# EAGLE schematic Micro_Rev1j (EAGLE 7.7.0)
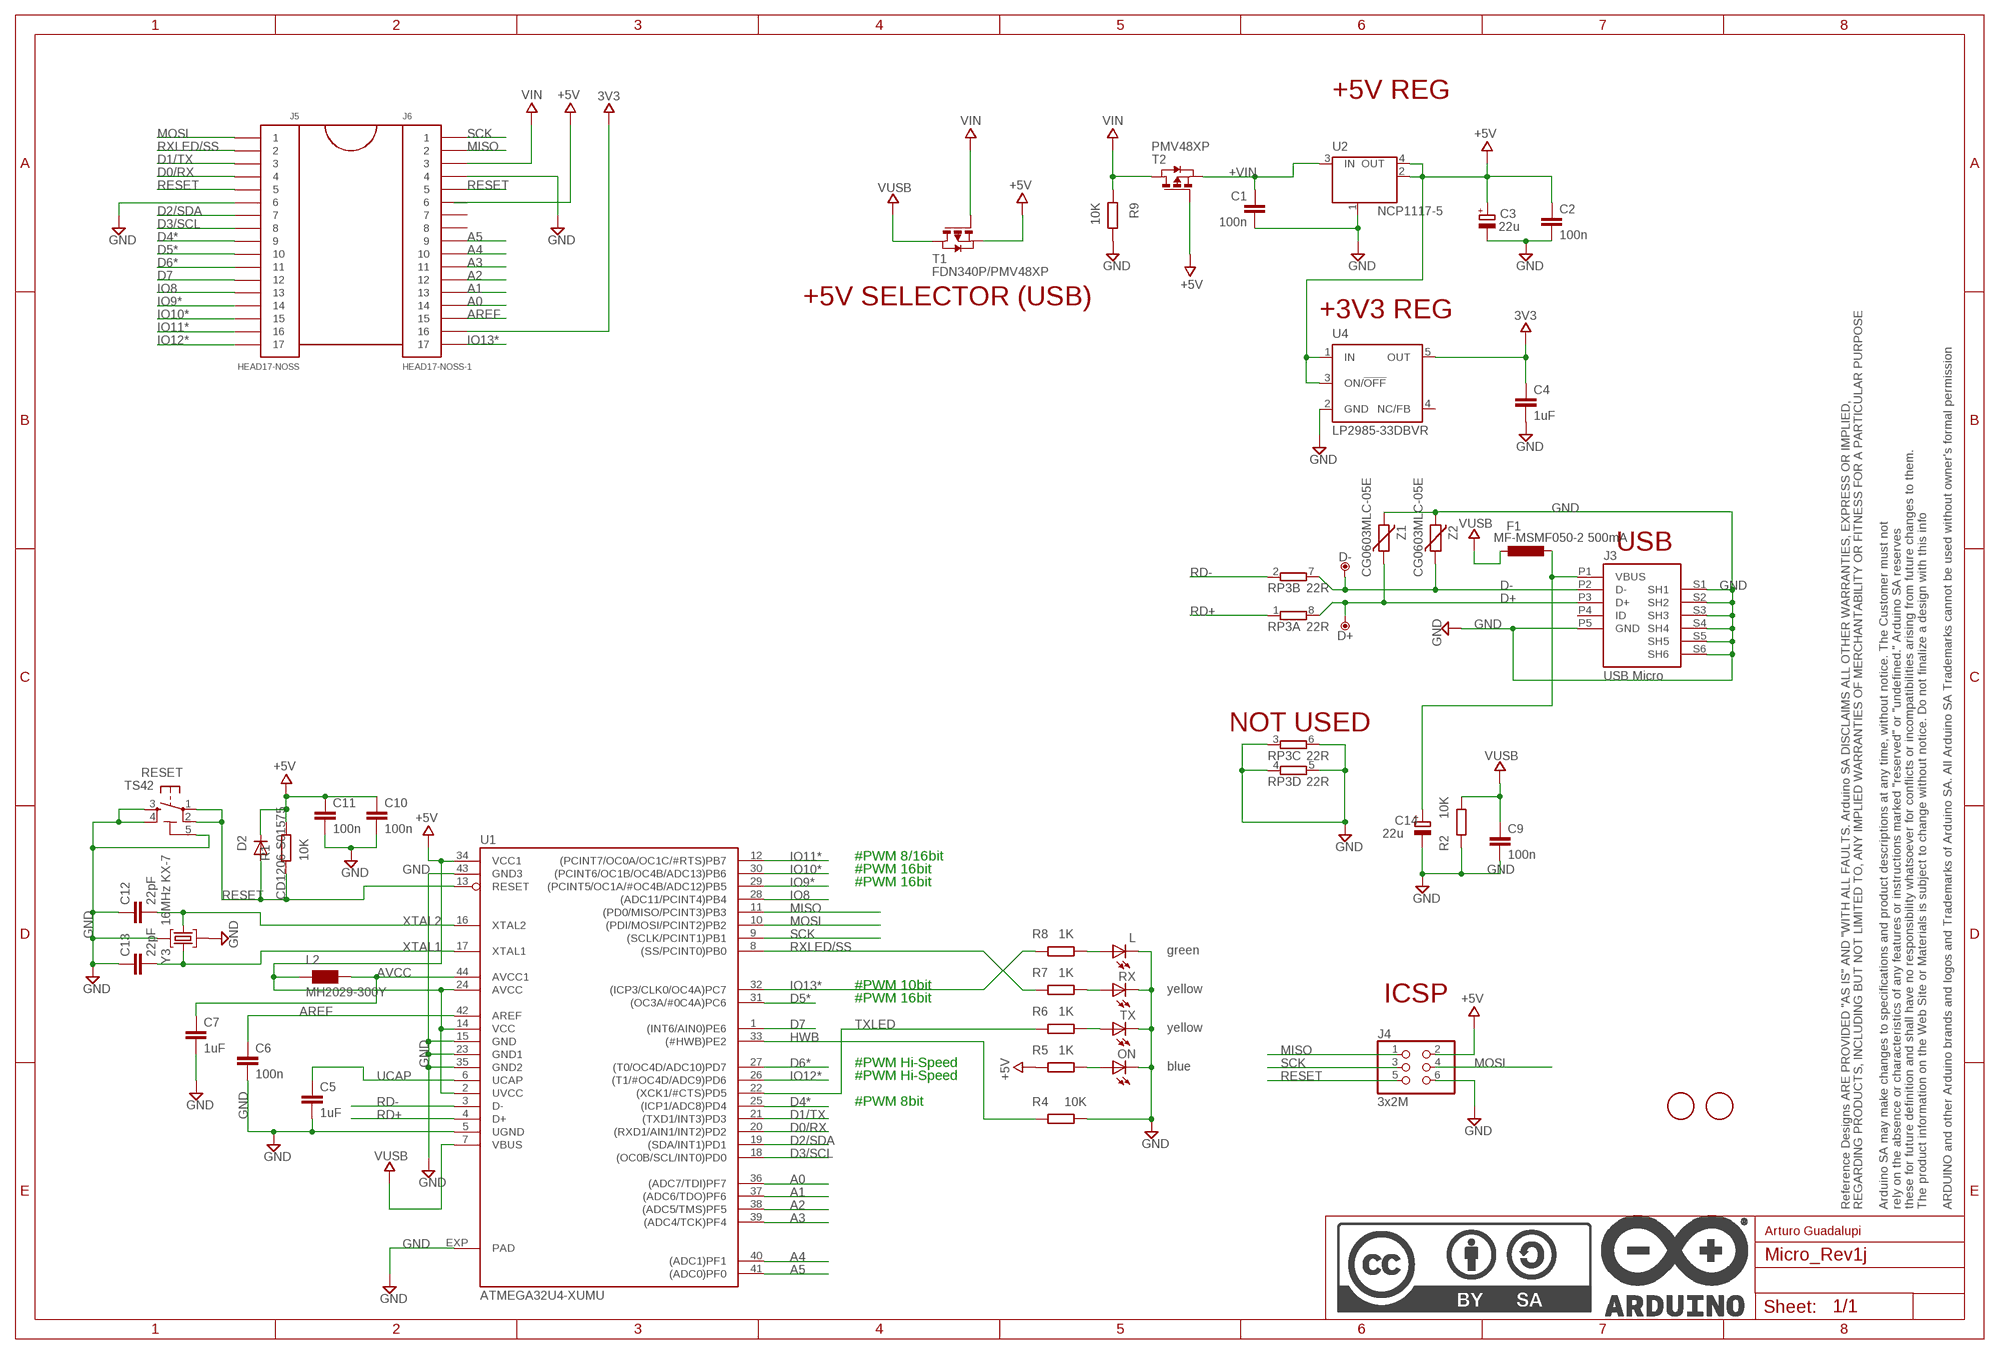
[diagram p0: schematic, sheet 1]

## Parts
C1  100n  C-EUC0402  [C0402]
C2  100n  C-EUC0402  [C0402]
C3  22u  CPOL-EUSMCB  [SMC_B]
C4  1uF  C-EUC0402  [C0402]
C5  1uF  C-EUC0402  [C0402]
C6  100n  C-EUC0402  [C0402]
C7  1uF  C-EUC0402  [C0402]
C9  100n  C-EUC0402  [C0402]
C10  100n  C-EUC0402  [C0402]
C11  100n  C-EUC0402  [C0402]
C12  22pF  C-EUC0402  [C0402]
C13  22pF  C-EUC0402  [C0402]
C14  22u  CPOL-EUSMCB  [SMC_B]
D2  CD1206-S01575  DIODE-MINIMELF  [MINIMELF]
D+  DNP  TPTP-1.00MM  [TP-1.00MM]
D-  DNP  TPTP-1.00MM  [TP-1.00MM]
F1  MF-MSMF050-2 500mA  L-EUL1812  [L1812]
FRAME1  DNP  A3-FRAME  [FRAME]
J3  USB Micro  USB-MICRO-LEGACY  [CON2_USB_MICRO_B_AT]
J4  3x2M  PINHD-2X3  [2X03]
J5  HEAD17-NOSS  [HEAD17-NOSS]
J6  HEAD17-NOSS-1  [HEAD17-NOSS-1]
L  green  LEDCHIPLED_0805  [CHIPLED_0805]
L2  MH2029-300Y  WE-CBF_0805  [0805]
ON  blue  LEDCHIPLED_0805  [CHIPLED_0805]
R1  10K  R-EU_R0402  [R0402]
R2  10K  R-EU_R0402  [R0402]
R4  10K  R-EU_R0402  [R0402]
R5  1K  R-EU_R0402  [R0402]
R6  1K  R-EU_R0402  [R0402]
R7  1K  R-EU_R0402  [R0402]
R8  1K  R-EU_R0402  [R0402]
R9  10K  R-EU_R0402  [R0402]
RESET  TS42  [TS42]
RP3  22R  4R-NCAY16  [CAY16]
RX  yellow  LEDCHIPLED_0805  [CHIPLED_0805]
T1  FDN340P/PMV48XP  PMOSSOT23  [SOT-23]
T2  PMV48XP  PMOSSOT23  [SOT-23]
TX  yellow  LEDCHIPLED_0805  [CHIPLED_0805]
U1  ATMEGA32U4-XUMU  [QFN44ML7X7]
U2  NCP1117-5  LINEAR_MC33269ST  [SOT223]
U4  LP2985-33DBVR  LP2985-XXDBVR33  [SOT23-DBV]
U$37  DNP  FIDUCIAL-1.5MM  [FD-1-1.5]
U$53  DNP  FIDUCIAL-1.5MM  [FD-1-1.5]
Y3  16MHz KX-7  CRYSTAL-3.2-2.5  [CRYSTAL-3.2-2.5]
Z1  CG0603MLC-05E  VARISTORCN0603  [CT/CN0603]
Z2  CG0603MLC-05E  VARISTORCN0603  [CT/CN0603]

## Nets
3V3: C4.1 J6.16 U4.5(OUT)
+5V: C2.1 C3.+ C10.1 C11.1 D2.C J4.2 J6.6 L2.1 R1.1 R5.1 T1.2(S) T2.3(G) U1.2(UVCC) U1.14(VCC) U1.24(AVCC) U1.34(VCC1) U2.2(OUT) U2.4(OUT) U4.1(IN) U4.3(ON/!OFF)
+VIN: C1.1 T2.2(S) U2.3(IN)
A0: J6.14 U1.36((ADC7/TDI)PF7)
A1: J6.13 U1.37((ADC6/TDO)PF6)
A2: J6.12 U1.38((ADC5/TMS)PF5)
A3: J6.11 U1.39((ADC4/TCK)PF4)
A4: J6.10 U1.40((ADC1)PF1)
A5: J6.9 U1.41((ADC0)PF0)
AREF: C6.1 J6.15 U1.42(AREF)
AVCC: C7.1 L2.2 U1.44(AVCC1)
D0/RX: J5.4 U1.20((RXD1/AIN1/INT2)PD2)
D1/TX: J5.3 U1.21((TXD1/INT3)PD3)
D2/SDA: J5.7 U1.19((SDA/INT1)PD1)
D3/SCL: J5.8 U1.18((OC0B/SCL/INT0)PD0)
D4*: J5.9 U1.25((ICP1/ADC8)PD4)
D5*: J5.10 U1.31((OC3A/#0C4A)PC6)
D6*: J5.11 U1.27((T0/OC4D/ADC10)PD7)
D7: J5.12 U1.1((INT6/AIN0)PE6)
D+: D+.X J3.P3(D+) RP3.8 Z1.1
D-: D-.X J3.P2(D-) RP3.7 Z2.1
GND: C1.2 C2.2 C3.- C4.2 C5.2 C6.2 C7.2 C9.2 C10.2 C11.2 C12.1 C13.1 C14.- J3.P5(GND) J3.S1(SH1) J3.S2(SH2) J3.S3(SH3) J3.S4(SH4) J3.S5(SH5) J3.S6(SH6) J4.6 J5.6 J6.4 L.C ON.C R2.1 R4.2 R9.1 RESET.3 RESET.4 RESET.5(5-GND) RP3.3 RP3.4 RP3.5 RP3.6 RX.C TX.C U1.5(UGND) U1.15(GND) U1.23(GND1) U1.35(GND2) U1.43(GND3) U1.EXP(PAD) U2.1(GND/ADJ) U4.2(GND) Y3.2(GND) Y3.4(GND) Z1.2 Z2.2
HWB: R4.1 U1.33((#HWB)PE2)
IO8: J5.13 U1.28((ADC11/PCINT4)PB4)
IO9*: J5.14 U1.29((PCINT5/OC1A/#OC4B/ADC12)PB5)
IO10*: J5.15 U1.30((PCINT6/OC1B/OC4B/ADC13)PB6)
IO11*: J5.16 U1.12((PCINT7/OC0A/OC1C/#RTS)PB7)
IO12*: J5.17 U1.26((T1/#OC4D/ADC9)PD6)
IO13*: J6.17 R8.1 U1.32((ICP3/CLK0/OC4A)PC7)
MISO: J4.1 J6.2 U1.11((PD0/MISO/PCINT3)PB3)
MOSI: J4.4 J5.1 U1.10((PDI/MOSI/PCINT2)PB2)
N$2: R7.2 RX.A
N$3: ON.A R5.2
N$4: R6.2 TX.A
N$7: L.A R8.2
RD+: RP3.1 U1.4(D+)
RD-: RP3.2 U1.3(D-)
RESET: D2.A J4.5 J5.5 J6.5 R1.2 RESET.1 RESET.2 U1.13(RESET)
RXLED/SS: J5.2 R7.1 U1.8((SS/PCINT0)PB0)
SCK: J4.3 J6.1 U1.9((SCLK/PCINT1)PB1)
TXLED: R6.1 U1.22((XCK1/#CTS)PD5)
UCAP: C5.1 U1.6(UCAP)
VIN: J6.3 R9.2 T1.3(G) T2.1(D)
VUSB: C9.1 F1.2 R2.2 T1.1(D) U1.7(VBUS)
VUSBD: C14.+ F1.1 J3.P1(VBUS)
XTAL1: C13.2 U1.17(XTAL1) Y3.3(C2)
XTAL2: C12.2 U1.16(XTAL2) Y3.1(C1)
Unconnected: J3.P4(ID) J6.7 J6.8 U4.4(NC/FB)

## Notes on the sheet
- +5V REG
- +5V SELECTOR (USB)
- +3V3 REG
- USB
- NOT USED
- #PWM 8/16bit
- #PWM 16bit
- #PWM 16bit
- #PWM 10bit
- #PWM 16bit | ICSP
- #PWM Hi-Speed
- #PWM Hi-Speed
- #PWM 8bit
- Arturo Guadalupi

## Library data of the parts
C1 C2 C4-C7 C9-C13 = gen_comp:C-EU: CAPACITOR, European symbol
C3 C14 = rcl:CPOL-EU: POLARIZED CAPACITOR, European symbol
D2 = diode:DIODE-: DIODE
D+ D- = Arduino-utility:TP: Testpoint; DATASHEET: DNP; DISTRIBUTOR-LINK: DNP; DISTRIBUTOR-PN: DNP; MANUFACTURER: DNP; MANUFACTURER-PN: DNP
F1 = rcl:L-EU: INDUCTOR, European symbol
FRAME1 = Arduino-utility:A3-FRAME; CODE-ARDUINO: DNP; DATASHEET: DNP; DISTRIBUTOR-LINK: DNP; DISTRIBUTOR-PN: DNP; MANUFACTURER: DNP; MANUFACTURER-PN: DNP; NOTE: DNP
J3 = Arduino-connectors:USB-MICRO-LEGACY; DATASHEET: http://media.digikey.com/pdf/Data%20Sheets/FCI%20PDFs/10118193-0001LF_Webpage.PDF; DISTRIBUTOR-LINK: http://www.digikey.it/product-detail/en/10118193-0001LF/609-4616-2-ND/2785388; DISTRIBUTOR-PN: 609-4616-2-ND; MANUFACTURER: FCI; MANUFACTURER-PN: 10118193-0001LF
J4 = gen_comp:PINHD-2X3: PIN HEADER
J5 = gen_comp:HEAD17-NOSS
J6 = gen_comp:HEAD17-NOSS-1
L ON RX TX = led:LED: LED OSRAM: - CHIPLED LG R971, LG N971, LY N971, LG Q971, LY Q971, LO R971, LY R971 LH N974, LH R974 LS Q976, LO Q976, LY Q976 LO Q996 - Hyper CHIPLED LW Q18S LB Q993, LB Q99A, LB R99A - SideLED LS A670, LO A670, LY A670, LG A670, LP A670 LB A673, LV A673, LT A673, LW A673 LH A674 LY A675 LS A676, LA A676, LO A676, LY A676, LW A676 LS A679, LY A679, LG A679 - Hyper Micro SIDELED® LS Y876, LA Y876, LO Y876, LY Y876 LT Y87S - SmartLED LW L88C, LW L88S LB L89C, LB L89S, LG L890 LS L89K, LO L89K, LY L89K LS L896, LA L896, LO L896, LY L896 - TOPLED LS T670, LO T670, LY T670, LG T670, LP T670 LSG T670, LSP T670, LSY T670, LOP T670, LYG T670 LG T671, LOG T671, LSG T671 LB T673, LV T673, LT T673, LW T673 LH T674 LS T676, LA T676, LO T676, LY T676, LB T676, LH T676, LSB T676, LW T676 LB T67C, LV T67C, LT T67C, LS T67K, LO T67K, LY T67K, LW E67C LS E67B, LA E67B, LO E67B, LY E67B, LB E67C, LV E67C, LT E67C LW T67C LS T679, LY T679, LG T679 LS T770, LO T770, LY T770, LG T770, LP T770 LB T773, LV T773, LT T773, LW T773 LH T774 LS E675, LA E675, LY E675, LS T675 LS T776, LA T776, LO T776, LY T776, LB T776 LHGB T686 LT T68C, LB T68C - Hyper Mini TOPLED® LB M676 - Mini TOPLED Santana® LG M470 LS M47K, LO M47K, LY M47K Source: http://www.osram.convergy.de LUXEON: - LUMILED® LXK2-PW12-R00, LXK2-PW12-S00, LXK2-PW14-U00, LXK2-PW14-V00 LXK2-PM12-R00, LXK2-PM12-S00, LXK2-PM14-U00 LXK2-PE12-Q00, LXK2-PE12-R00, LXK2-PE12-S00, LXK2-PE14-T00, LXK2-PE14-U00 LXK2-PB12-K00, LXK2-PB12-L00, LXK2-PB12-M00, LXK2-PB14-N00, LXK2-PB14-P00, LXK2-PB14-Q00 LXK2-PR12-L00, LXK2-PR12-M00, LXK2-PR14-Q00, LXK2-PR14-R00 LXK2-PD12-Q00, LXK2-PD12-R00, LXK2-PD12-S00 LXK2-PH12-R00, LXK2-PH12-S00 LXK2-PL12-P00, LXK2-PL12-Q00, LXK2-PL12-R00 Source: www.luxeon.com KINGBRIGHT: KA-3528ASYC Source: www.kingbright.com
L2 = wuerth-elektronik:WE-CBF: SMD EMI Suppression Ferrite Beads - excellent anti-EMI properties - low DCR - impedances till 3000 ohms - rated current up to 6 A
R1 R2 R4-R9 = gen_comp:R-EU_: RESISTOR, European symbol
RESET = Arduino:TS42: TS42 Dongnan Electronics Tact switch VDC 12V - 50mA
RP3 = resistor-dil:4R-N: Array Chip Resistor Source: RS Component / Phycomp
T1 T2 = zetex:PMOSSOT23: MOS FET
U1 = gen_comp:ATMEGA32U4-XU
U2 = gen_comp:LINEAR_MC33269ST*: Adjustable Output Low Dropout Voltage Regulator 800 mA Source: http://www.onsemi.com/pub/Collateral/MC33269-D.PDF
U4 = gen_comp:LP2985-XXDBVR: ULTRALOW-POWER 50-mA LOW-DROPOUT LINEAR REGULATORS 50-mA Low-Dropout Regulator Source: http://focus.ti.com/lit/ds/symlink/tps77001.pdf
U$37 U$53 = Arduino-utility:FIDUCIAL: Fiducial mount; DATASHEET: DNP; DISTRIBUTOR-LINK: DNP; DISTRIBUTOR-PN: DNP; MANUFACTURER: DNP; MANUFACTURER-PN: DNP
Y3 = gen_comp:CRYSTAL-3.2-2.5
Z1 Z2 = varistor:VARISTOR: VARISTOR

## Net classes
0 default: width 0.254 mm, drill 0.5 mm, clearance 0.203 mm